# Altium schematic sheet Power24V.SchDoc
size 283 x 191 mm; SheetNumber: 1; SheetTotal: 1
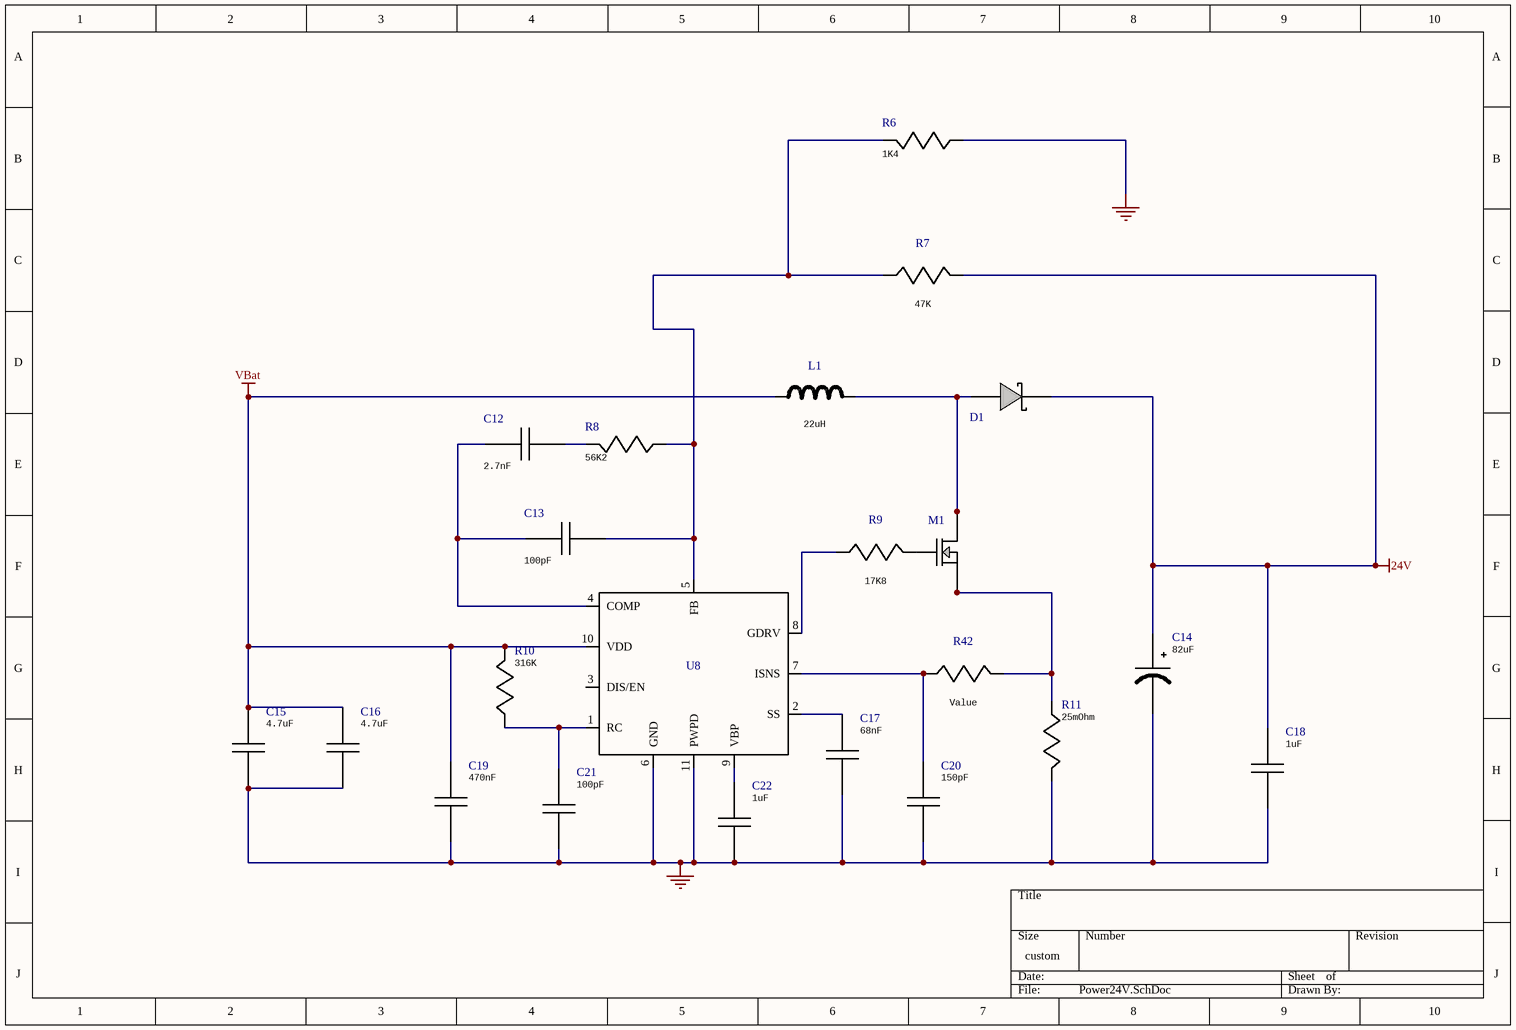
[diagram p0: Power24V.SchDoc]

## Parts
C12  value 2.7nF  [1608]  (hidden comment: CC0805KRX7R9BB27)
C13  value 100pF  [1608]  (hidden comment: CC0805JRNPO9BN10)
C14  value 82uF  [CAPSMT_62_E12]  (hidden comment: 35SVPF82M)
C15  value 4.7uF  [0805]  (hidden comment: GRM21BR61E475MA1)
C16  value 4.7uF  [0805]  (hidden comment: GRM21BR61E475MA1)
C17  value 68nF  [1608]  (hidden comment: GRM155R61A683KA0)
C18  value 1uF  [0805]  (hidden comment: GMK212B7105KG-T)
C19  value 470nF  [0805]  (hidden comment: EMK212B7474KD-T)
C20  value 150pF  [0805]  (hidden comment: CC0805JRNPO9BN15)
C21  value 100pF  [1608]  (hidden comment: CC0805JRNPO9BN10)
C22  value 1uF  [1608]  (hidden comment: C1608X5R1C105K)
D1  B240A-13-F  [SMA]  (value not drawn)
L1  value 22uH  [SRR1210]  (hidden comment: SRR1210-220M)
M1  CSD17551Q5A  [TRANS_NexFET_Q5A]  (value not drawn)
R6  value 1K4  [1608]  (hidden comment: CRCW04021K40FKED)
R7  value 47K  [1608]  (hidden comment: RR1220P-473-D)
R8  value 56K2  [1608]  (hidden comment: CRCW040256K2FKED)
R9  value 17K8  [1608]  (hidden comment: CRCW040217R8FKED)
R10  value 316K  [1608]  (hidden comment: CRCW0402316KFKED)
R11  value 25mOhm  [1206]  (hidden comment: CSR1206FK25L0)
R42  CRCW04021K00FKED  [1608]  (value not drawn)
U8  TPS40210DGQR  [S-PDSO-G10]  (value not drawn)

## Nets
24V: C14.1(+) C18.1 D1.1(K) R7.1
GND: C14.2(-) C15.2 C16.2 C17.2 C18.2 C19.2 C20.2 C21.2 C22.2 R6.2 R11.1 U8.6(GND) U8.11(PWPD)
VBat: C15.1 C16.1 C19.1 L1.1 R10.1 U8.10(VDD)
NetC12_1: C12.1 C13.1 U8.4(COMP)
NetC12_2: C12.2 R8.1
NetC13_2: C13.2 R6.1 R7.2 R8.2 U8.5(FB)
NetC17_1: C17.1 U8.2(SS)
NetC20_1: C20.1 R42.2 U8.7(ISNS)
NetC21_1: C21.1 R10.2 U8.1(RC)
NetC22_1: C22.1 U8.9(VBP)
NetD1_2: D1.2(A) L1.2 M1.5(Drain) M1.6(Drain) M1.7(Drain) M1.8(Drain) M1.9(Drain)
NetM1_1: M1.1(Source) M1.2(Source) M1.3(Source) R11.2 R42.1
NetM1_4: M1.4(Gate) R9.1
NetR9_2: R9.2 U8.8(GDRV)

Not connected (* = marked no-connect by the designer): U8 3(DIS/EN)

## Library data of the parts
C12 = CC0805KRX7R9BB27: Imported; Manufacturer_Part_Number: CC0805KRX7R9BB272; Vendor: Yageo America; RefName: Ccomp; Manufacturer_Name: Yageo America; RefDes: RefDes; TYPE: TYPE
C13 = CC0805JRNPO9BN10: Imported; Manufacturer_Part_Number: CC0805JRNPO9BN101; Vendor: Yageo America; RefName: Ccomp2; Manufacturer_Name: Yageo America; RefDes: RefDes; TYPE: TYPE
C14 = 35SVPF82M: Imported; Vendor: Panasonic; RN: Cout; Manufacturer_Part_Number: 35SVPF82M; Manufacturer_Name: Panasonic; RefDes: RefDes; TYPE: TYPE
C15 C16 = GRM21BR61E475MA1: Imported; Manufacturer_Part_Number: GRM21BR61E475MA12L; Vendor: MuRata; RefName: Cin; Manufacturer_Name: MuRata; RefDes: RefDes; TYPE: TYPE
C17 = GRM155R61A683KA0: Imported; Manufacturer_Part_Number: GRM155R61A683KA01D; Vendor: MuRata; RN: Css; Manufacturer_Name: MuRata; RefDes: RefDes; TYPE: TYPE
C18 = GMK212B7105KG-T: Imported; Vendor: Taiyo Yuden; RN: Coutx; Manufacturer_Part_Number: GMK212B7105KG-T; Manufacturer_Name: Taiyo Yuden; RefDes: RefDes; TYPE: TYPE
C19 = EMK212B7474KD-T: Imported; Vendor: Taiyo Yuden; RefName: Cbyp; Manufacturer_Part_Number: EMK212B7474KD-T; Manufacturer_Name: Taiyo Yuden; RefDes: RefDes; TYPE: TYPE
C20 = CC0805JRNPO9BN15: Imported; Manufacturer_Part_Number: CC0805JRNPO9BN151; Vendor: Yageo America; RN: Ciflt; Manufacturer_Name: Yageo America; RefDes: RefDes; TYPE: TYPE
C21 = CC0805JRNPO9BN10: Imported; Manufacturer_Part_Number: CC0805JRNPO9BN101; Vendor: Yageo America; RefName: Crc; Manufacturer_Name: Yageo America; RefDes: RefDes; TYPE: TYPE
C22 = C1608X5R1C105K: Imported; Vendor: TDK; RefName: Cbp; Manufacturer_Part_Number: C1608X5R1C105K; Manufacturer_Name: TDK; RefDes: RefDes; TYPE: TYPE
D1 = B240A-13-F: Imported; Vendor: Diodes Inc.; Value: Value; Manufacturer_Part_Number: B240A-13-F; Manufacturer_Name: Diodes Inc.; RefDes: RefDes; Type: Type
L1 = SRR1210-220M: Imported; Vendor: Bourns; Manufacturer_Part_Number: SRR1210-220M; Manufacturer_Name: Bourns; RefDes: RefDes; TYPE: TYPE
M1 = CSD17551Q5A: Imported; Vendor: Texas Instruments; Value: Value; Manufacturer_Part_Number: CSD17551Q5A; Manufacturer_Name: Texas Instruments; RefDes: RefDes; TYPE: TYPE
R6 = CRCW04021K40FKED: Imported; Vendor: Vishay-Dale; RN: Rfb1; Manufacturer_Part_Number: CRCW04021K40FKED; Manufacturer_Name: Vishay-Dale; RefDes: RefDes; TYPE: TYPE
R7 = RR1220P-473-D: Imported; Vendor: Susumu Co Ltd; RN: Rfb2; Manufacturer_Part_Number: RR1220P-473-D; Manufacturer_Name: Susumu Co Ltd; RefDes: RefDes; TYPE: TYPE
R8 = CRCW040256K2FKED: Imported; Vendor: Vishay-Dale; RefName: Rcomp; Manufacturer_Part_Number: CRCW040256K2FKED; Manufacturer_Name: Vishay-Dale; RefDes: RefDes; TYPE: TYPE
R9 = CRCW040217R8FKED: Imported; Vendor: Vishay-Dale; RN: Rg; Manufacturer_Part_Number: CRCW040217R8FKED; Manufacturer_Name: Vishay-Dale; RefDes: RefDes; TYPE: TYPE
R10 = CRCW0402316KFKED: Imported; Vendor: Vishay-Dale; RefName: Rrc; Manufacturer_Part_Number: CRCW0402316KFKED; Manufacturer_Name: Vishay-Dale; RefDes: RefDes; TYPE: TYPE
R11 = CSR1206FK25L0: Imported; Vendor: Stackpole Electronics Inc; rn: Rsense; Manufacturer_Part_Number: CSR1206FK25L0; Manufacturer_Name: Stackpole Electronics Inc; RefDes: RefDes; TYPE: TYPE
R42 = CRCW04021K00FKED: Riflt; Vendor: Vishay-Dale; Value: Value; Manufacturer_Part_Number: CRCW04021K00FKED; Manufacturer_Name: Vishay-Dale; RefDes: RefDes; TYPE: TYPE
U8 = TPS40210DGQR: Imported; Vendor: Texas Instruments; Value: Value; Manufacturer_Part_Number: TPS40210DGQR; Manufacturer_Name: Texas Instruments; RefDes: RefDes; TYPE: TYPE